# EAGLE design ed097oc4 (EAGLE 9.5.0)
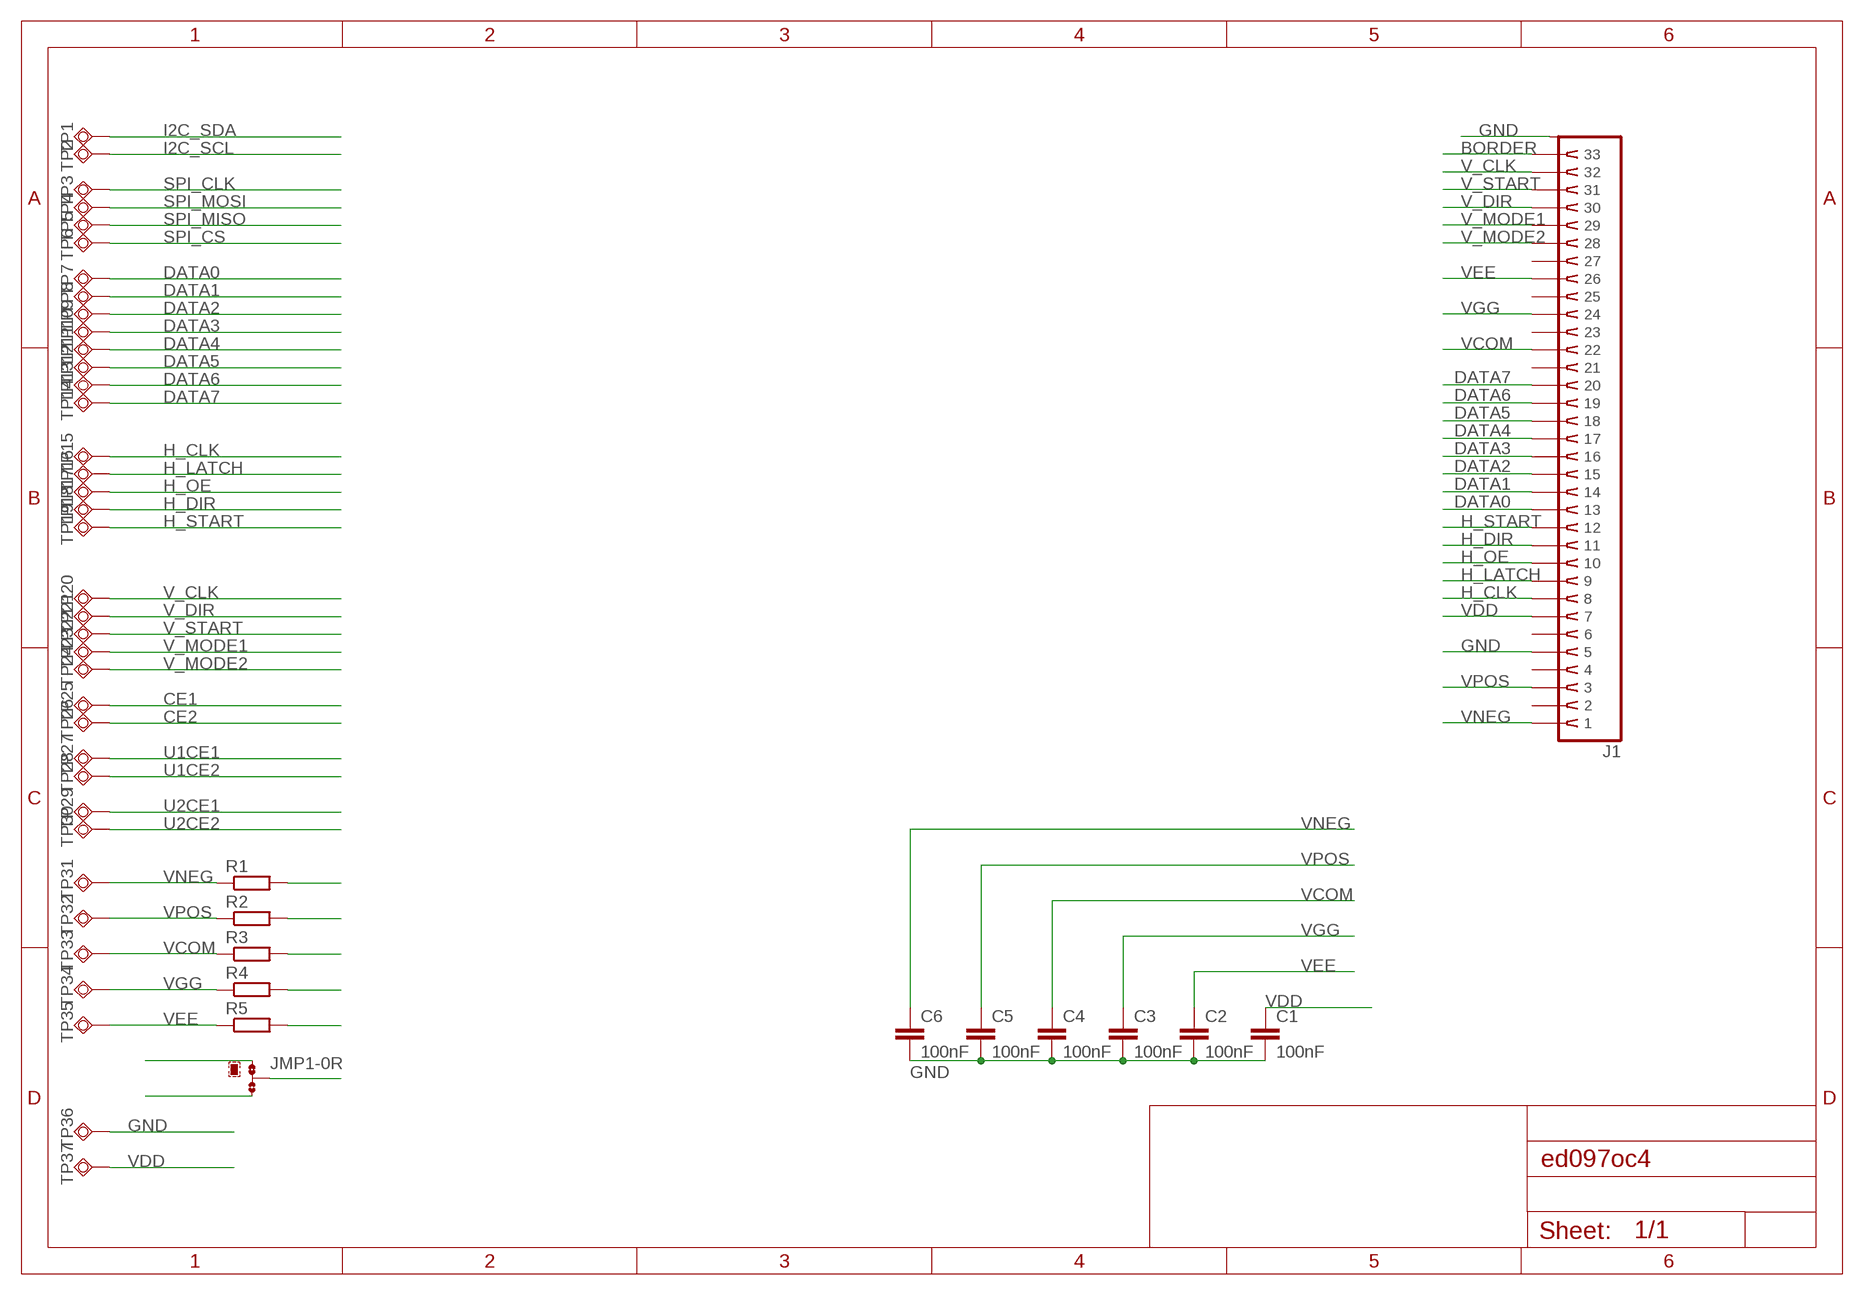
[diagram p0: schematic, sheet 1]

## Parts
C1  100nF  C-EUC0805  [C0805]
C2  100nF  C-EUC0805  [C0805]
C3  100nF  C-EUC0805  [C0805]
C4  100nF  C-EUC0805  [C0805]
C5  100nF  C-EUC0805  [C0805]
C6  100nF  C-EUC0805  [C0805]
J1  SFV33R  [SFV33R-1STE1LF]
JMP1  0R-JUMPA  [A0R-JMP]
R1  R-EU_R0805  [R0805]
R2  R-EU_R0805  [R0805]
R3  R-EU_R0805  [R0805]
R4  R-EU_R0805  [R0805]
R5  R-EU_R0805  [R0805]
TP1  TESTPAD0.6  [VIA0.6]
TP2  TESTPAD0.6  [VIA0.6]
TP3  TESTPAD0.6  [VIA0.6]
TP4  TESTPAD0.6  [VIA0.6]
TP5  TESTPAD0.6  [VIA0.6]
TP6  TESTPAD0.6  [VIA0.6]
TP7  TESTPAD0.6  [VIA0.6]
TP8  TESTPAD0.6  [VIA0.6]
TP9  TESTPAD0.6  [VIA0.6]
TP10  TESTPAD0.6  [VIA0.6]
TP11  TESTPAD0.6  [VIA0.6]
TP12  TESTPAD0.6  [VIA0.6]
TP13  TESTPAD0.6  [VIA0.6]
TP14  TESTPAD0.6  [VIA0.6]
TP15  TESTPAD0.6  [VIA0.6]
TP16  TESTPAD0.6  [VIA0.6]
TP17  TESTPAD0.6  [VIA0.6]
TP18  TESTPAD0.6  [VIA0.6]
TP19  TESTPAD0.6  [VIA0.6]
TP20  TESTPAD0.6  [VIA0.6]
TP21  TESTPAD0.6  [VIA0.6]
TP22  TESTPAD0.6  [VIA0.6]
TP23  TESTPAD0.6  [VIA0.6]
TP24  TESTPAD0.6  [VIA0.6]
TP25  TESTPAD0.6  [VIA0.6]
TP26  TESTPAD0.6  [VIA0.6]
TP27  TESTPAD0.6  [VIA0.6]
TP28  TESTPAD0.6  [VIA0.6]
TP29  TESTPAD0.6  [VIA0.6]
TP30  TESTPAD0.6  [VIA0.6]
TP31  TESTPAD0.6  [VIA0.6]
TP32  TESTPAD0.6  [VIA0.6]
TP33  TESTPAD0.6  [VIA0.6]
TP34  TESTPAD0.6  [VIA0.6]
TP35  TESTPAD0.6  [VIA0.6]
TP36  TESTPAD0.6  [VIA0.6]
TP37  TESTPAD0.6  [VIA0.6]

## Nets
BORDER: J1.33
CE1: TP25.P$1(TP)
CE2: TP26.P$1(TP)
DATA0: J1.13 TP7.P$1(TP)
DATA1: J1.14 TP8.P$1(TP)
DATA2: J1.15 TP9.P$1(TP)
DATA3: J1.16 TP10.P$1(TP)
DATA4: J1.17 TP11.P$1(TP)
DATA5: J1.18 TP12.P$1(TP)
DATA6: J1.19 TP13.P$1(TP)
DATA7: J1.20 TP14.P$1(TP)
GND: C1.2 C2.2 C3.2 C4.2 C5.2 C6.2 J1.5 J1.SHLD1(SHLD) J1.SHLD2(SHLD) TP36.P$1(TP)
H_CLK: J1.8 TP15.P$1(TP)
H_DIR: J1.11 TP18.P$1(TP)
H_LATCH: J1.9 TP16.P$1(TP)
H_OE: J1.10 TP17.P$1(TP)
H_START: J1.12 TP19.P$1(TP)
I2C_SCL: TP2.P$1(TP)
I2C_SDA: TP1.P$1(TP)
N$1: JMP1.2
N$2: JMP1.1
N$3: JMP1.3
N$6: R1.2
N$7: R2.2
N$8: R3.2
N$9: R4.2
N$10: R5.2
SPI_CLK: TP3.P$1(TP)
SPI_CS: TP6.P$1(TP)
SPI_MISO: TP5.P$1(TP)
SPI_MOSI: TP4.P$1(TP)
U1CE1: TP27.P$1(TP)
U1CE2: TP28.P$1(TP)
U2CE1: TP29.P$1(TP)
U2CE2: TP30.P$1(TP)
V_CLK: J1.32 TP20.P$1(TP)
V_DIR: J1.30 TP21.P$1(TP)
V_MODE1: J1.29 TP23.P$1(TP)
V_MODE2: J1.28 TP24.P$1(TP)
V_START: J1.31 TP22.P$1(TP)
VCOM: C4.1 J1.22 R3.1 TP33.P$1(TP)
VDD: C1.1 J1.7 TP37.P$1(TP)
VEE: C2.1 J1.26 R5.1 TP35.P$1(TP)
VGG: C3.1 J1.24 R4.1 TP34.P$1(TP)
VNEG: C6.1 J1.1 R1.1 TP31.P$1(TP)
VPOS: C5.1 J1.3 R2.1 TP32.P$1(TP)
Unconnected: J1.2 J1.4 J1.6 J1.21 J1.23 J1.25 J1.27

## Library data of the parts
C1-C6 = rcl:C-EU: CAPACITOR, European symbol; SPICEPREFIX: C
J1 = parts-amphenol:SFV33R
JMP1 = jump-0r-smd:0R-JUMP: SMD 0R 0805 Jumper
R1-R5 = rcl:R-EU_: RESISTOR, European symbol; SPICEPREFIX: R
TP1-TP37 = parts-passives:TESTPAD

## Board
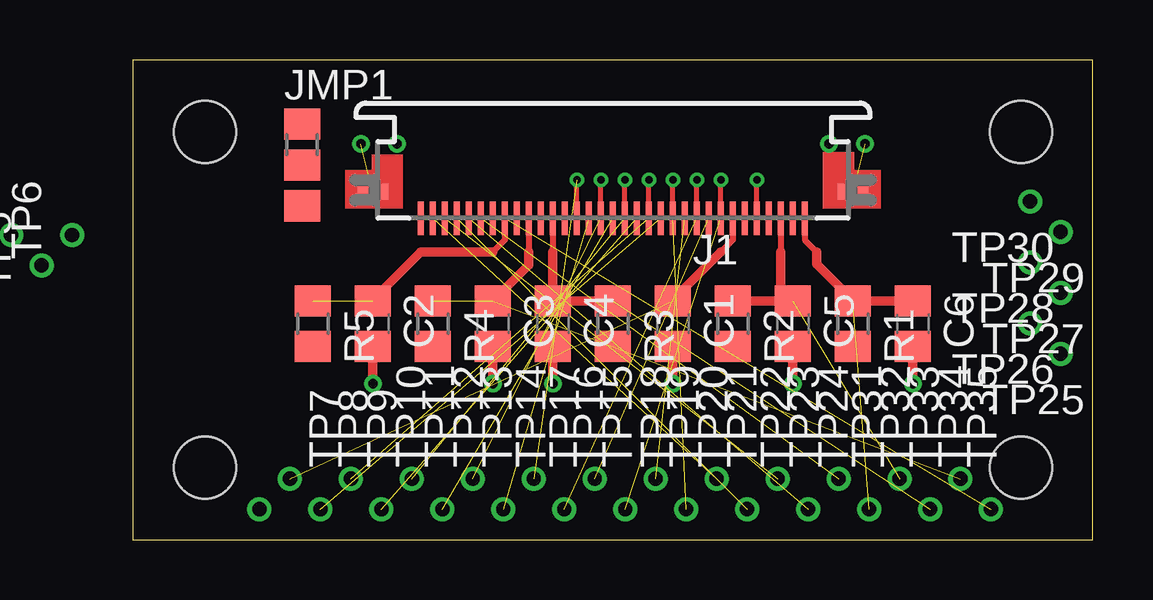
[diagram p1: board, top side]
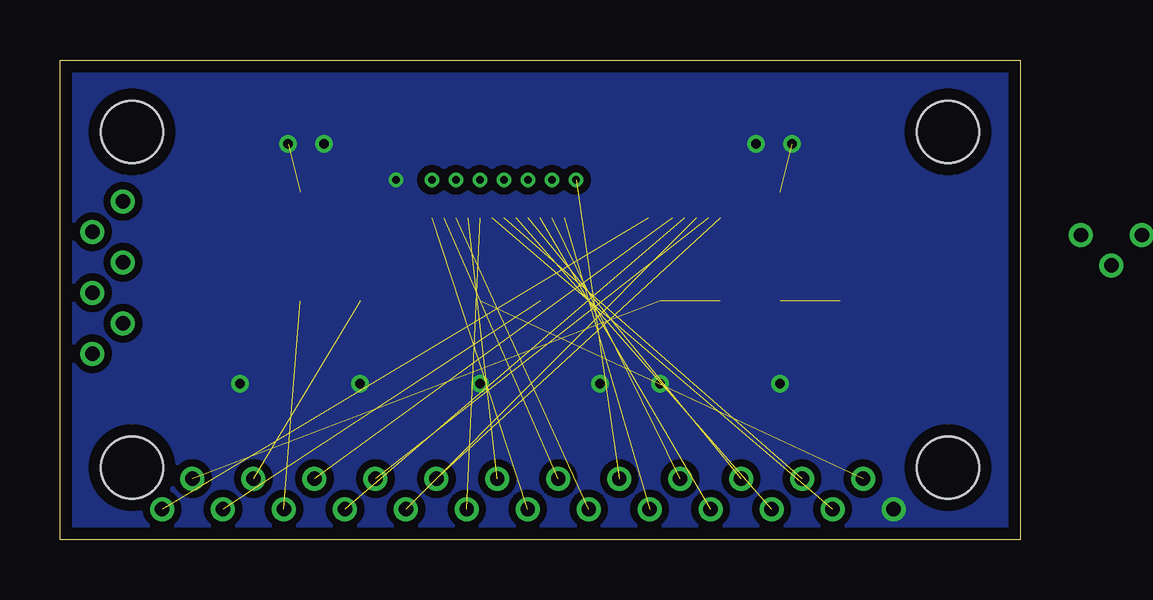
[diagram p2: board, bottom side, seen from below]

Size 40 x 20 mm. Coordinates in mm from the lower left corner, seen from the top.
Outline: 0,0 40,0 40,20 0,20 0,0
Copper layers (1*16): Top 0.035mm / dielectric 0.5mm / Bottom 0.035mm
Design rules "default *": minimum track width 6mil, minimum drill 0.3mm, track to track 6mil, track to pad 6mil, pad to pad 6mil, via to via 6mil, smd to smd 6mil, copper to edge 0.5mm, drill to drill 6mil, minimum pad ring 0.2mm, minimum via ring 0.16mm, stop-mask expansion 4mil, vias tented up to drill 0mil, thermal gap 10mil
Holes 2.6 mm at 3,3 37,3 3,17 37,17

### Footprints (pad centres in the part's own frame; a part is rotated, then mirrored left to right if it is on the bottom)
C0805 = smd 1.3 x 1.5: 1 -0.95,0; 2 0.95,0
SFV33R-1STE1LF = smd 0.25 x 1.4: 1 -8,0.6; 2 -7.5,0.6; 3 -7,0.6; 4 -6.5,0.6; 5 -6,0.6; 6 -5.5,0.6; 7 -5,0.6; 8 -4.5,0.6; 9 -4,0.6; 10 -3.5,0.6; 11 -3,0.6; 12 -2.5,0.6; 13 -2,0.6; 14 -1.5,0.6; 15 -1,0.6; 16 -0.5,0.6; 17 0,0.6; 18 0.5,0.6; 19 1,0.6; 20 1.5,0.6; 21 2,0.6; 22 2.5,0.6; 23 3,0.6; 24 3.5,0.6; 25 4,0.6; 26 4.5,0.6; 27 5,0.6; 28 5.5,0.6; 29 6,0.6; 30 6.5,0.6; 31 7,0.6; 32 7.5,0.6; 33 8,0.6 | smd 1.27 x 0.635: SHLD1 -10,-0.5; SHLD2 10,-0.5
A0R-JMP = smd 1.5 x 1.3: 1 0,1.7; 2 0,0; 3 0,-1.7
R0805 = smd 1.3 x 1.5: 1 -0.95,0; 2 0.95,0
VIA0.6 = drill 0.6 pad 0.9: P$1 0,0

### Placement (x,y rotation side)
C1  22.5,9 270 top
C2  10,9 270 top
C3  15,9 270 top
C4  17.5,9 270 top
C5  27.5,9 270 top
C6  32.5,9 270 top
J1  20,14 180 top
JMP1  7.05,15.62 0 top
R1  30,9 270 top
R2  25,9 270 top
R3  20,9 270 top
R4  12.5,9 270 top
R5  7.5,9 270 top
TP1  -8.89,11.43 90 top  (outside the outline)
TP2  -7.62,12.7 90 top  (outside the outline)
TP3  -6.35,11.43 90 top  (outside the outline)
TP4  -5.08,12.7 90 top  (outside the outline)
TP5  -3.81,11.43 90 top  (outside the outline)
TP6  -2.54,12.7 90 top
TP7  7.81,1.27 90 top
TP8  9.08,2.54 90 top
TP9  10.35,1.27 90 top
TP10  11.62,2.54 90 top
TP11  12.89,1.27 90 top
TP12  14.16,2.54 90 top
TP13  15.43,1.27 90 top
TP14  16.7,2.54 90 top
TP15  20.51,1.27 90 top
TP16  19.24,2.54 90 top
TP17  17.97,1.27 90 top
TP18  21.78,2.54 90 top
TP19  23.05,1.27 90 top
TP20  24.32,2.54 90 top
TP21  25.59,1.27 90 top
TP22  26.86,2.54 90 top
TP23  28.13,1.27 90 top
TP24  29.4,2.54 90 top
TP25  38.65,7.75 180 top
TP26  37.38,9.02 180 top
TP27  38.65,10.29 180 top
TP28  37.38,11.56 180 top
TP29  38.65,12.83 180 top
TP30  37.38,14.1 180 top
TP31  30.67,1.27 90 top
TP32  31.94,2.54 90 top
TP33  33.21,1.27 90 top
TP34  34.48,2.54 90 top
TP35  35.75,1.27 90 top
TP36  5.27,1.27 0 top
TP37  6.54,2.54 0 top

### Tracks (layer width: path | path; a pad name or v marks a point on that pad's centre or on a via)
DATA0  (1 unrouted)
DATA1  (via drill 0.3)  (1 unrouted)
  Top 0.2: J1.14 v21.5,15
DATA2  (1 unrouted)
DATA3  (via drill 0.3)  (1 unrouted)
  Top 0.2: J1.16 v20.5,15
DATA4  (1 unrouted)
DATA5  (via drill 0.3)  (1 unrouted)
  Top 0.2: J1.18 v19.5,15
DATA6  (1 unrouted)
DATA7  (via drill 0.3)  (1 unrouted)
  Top 0.2: J1.20 v18.5,15
GND  (via drill 0.3, 0.4)  (2 unrouted)
  Top 0.2: J1.5 v26,15
  Top 0.4: C6.2 v32.5,6.5 | C5.2 v27.5,6.5 | C1.2 v22.5,6.5 | C4.2 v17.5,6.5 | C3.2 v15,6.5 | C2.2 v10,6.5
  other vias: 9.5,16.5 11,16.5 29,16.5 30.5,16.5
  pour Bottom (isolate 0.3, rank 6, no thermals): -1,21 41,21 41,-1 -1,-1
H_CLK  (via drill 0.3)  (1 unrouted)
  Top 0.2: J1.8 v24.5,15
H_DIR  (1 unrouted)
H_LATCH  (1 unrouted)
H_OE  (via drill 0.3)  (1 unrouted)
  Top 0.2: J1.10 v23.5,15
H_START  (via drill 0.3)  (1 unrouted)
  Top 0.2: J1.12 v22.5,15
V_CLK  (1 unrouted)
V_DIR  (1 unrouted)
V_MODE1  (1 unrouted)
V_MODE2  (1 unrouted)
V_START  (1 unrouted)
VCOM  (1 unrouted)
  Top 0.25: J1.22 17.5,12
  Top 0.4: 17.5,12 C4.1 R3.1
VDD  (1 unrouted)
  Top 0.25: J1.7 25,12.5 24.5,12
  Top 0.4: 24.5,12 22.5,10 C1.1
VEE  (2 unrouted)
  Top 0.25: J1.26 15.5,12.5 15,12
  Top 0.4: 15,12 12,12 10,10 C2.1
VGG  (2 unrouted)
  Top 0.25: J1.24 16.5,12
  Top 0.4: 16.5,12 16.5,11.45 C3.1
VNEG  (1 unrouted)
  Top 0.25: J1.1 28,12.5 28.5,12
  Top 0.4: 28.5,12 28.5,11.5 30,10 R1.1 C6.1
VPOS  (1 unrouted)
  Top 0.25: J1.3 27,12
  Top 0.4: 27,12 27,10.45 C5.1 R2.1